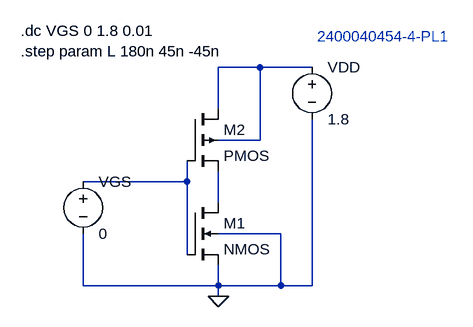
[diagram p0: schematic lab1.asc]
lab1.asc, the LTspice schematic file:
Version 4.1
SHEET 1 880 680
WIRE 304 -48 240 -48
WIRE 384 -48 304 -48
WIRE 240 16 240 -48
WIRE 304 64 304 -48
WIRE 304 64 240 64
WIRE 192 128 192 96
WIRE 192 128 32 128
WIRE 240 160 240 112
WIRE 336 208 240 208
WIRE 192 240 192 128
WIRE 32 288 32 208
WIRE 240 288 240 256
WIRE 240 288 32 288
WIRE 336 288 336 208
WIRE 336 288 240 288
WIRE 384 288 384 32
WIRE 384 288 336 288
WIRE 240 304 240 288
FLAG 240 304 0
SYMBOL pmos4 192 16 R0
SYMATTR InstName M2
SYMATTR Value2 l={L} w=2u
SYMBOL nmos4 192 160 R0
SYMATTR InstName M1
SYMATTR Value2 l={L} w=1u
SYMBOL voltage 384 -64 R0
WINDOW 123 0 0 Left 0
WINDOW 39 0 0 Left 0
SYMATTR InstName VDD
SYMATTR Value 1.8
SYMBOL voltage 32 112 R0
WINDOW 123 0 0 Left 0
WINDOW 39 0 0 Left 0
SYMATTR InstName VGS
SYMATTR Value 0
TEXT -64 -104 Left 2 !.dc VGS 0 1.8 0.01\n.step param L 180n 45n -45n
TEXT 392 -96 Left 2 ;2400040454-4-PL1

The netlist it stands for:
* lab1.asc
M2 N001 N002 N003 N001 PMOS l={L} w=2u
M1 N003 N002 0 0 NMOS l={L} w=1u
VDD N001 0 1.8
VGS N002 0 0
.model NMOS NMOS
.model PMOS PMOS
.lib standard.mos
.dc VGS 0 1.8 0.01
.step param L 180n 45n -45n
* 2400040454-4-PL1
.backanno
.end